# EAGLE design controlBoard-0.5 (EAGLE 8.6.3)
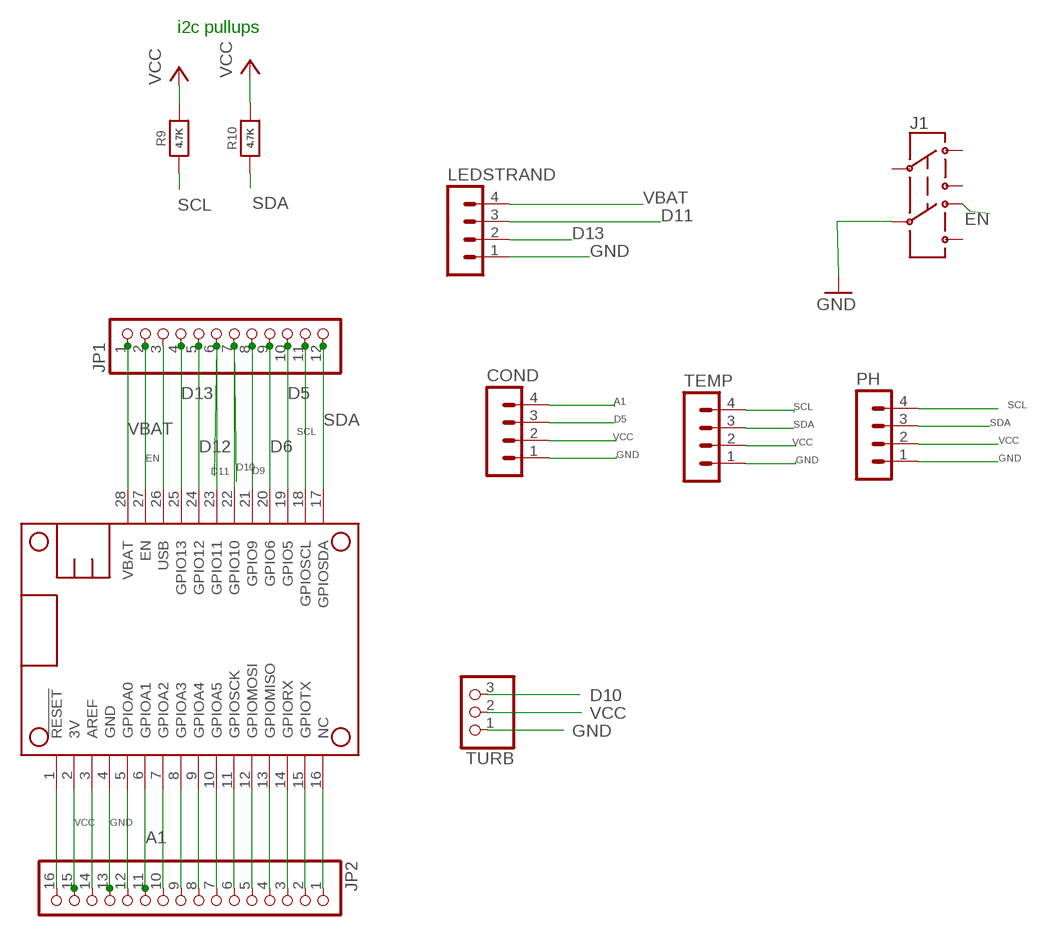
[diagram p0: schematic, sheet 1]

## Parts
COND  MA04-1  [MA04-1]
J1  AYZ0202  [AYZ0202]
JP1  PINHD-1X12  [1X12]
JP2  PINHD-1X16  [1X16]
LEDSTRAND  MA04-1  [MA04-1]
MS1  FEATHERWING  [FEATHERWING]
PH  MA04-1  [MA04-1]
R9  4.7K  RESISTOR_0603_NOOUT  [0603-NO]
R10  4.7K  RESISTOR_0603_NOOUT  [0603-NO]
TEMP  MA04-1  [MA04-1]
TURB  PINHD-1X3  [1X03]

## Nets
A1: COND.4 JP2.11 MS1.6(GPIOA1)
D5: COND.3 JP1.10 MS1.19(GPIO5)
D6: JP1.9 MS1.20(GPIO6)
D9: JP1.8 MS1.21(GPIO9)
D10: JP1.7 MS1.22(GPIO10) TURB.3
D11: JP1.6 LEDSTRAND.3 MS1.23(GPIO11)
D12: JP1.5 MS1.24(GPIO12)
D13: JP1.4 LEDSTRAND.2 MS1.25(GPIO13)
EN: J1.6 JP1.2 MS1.27(EN)
GND: COND.1 J1.5 JP2.13 LEDSTRAND.1 MS1.4(GND) PH.1 TEMP.1 TURB.1
N$2: JP2.1 MS1.16(NC)
N$3: JP2.2 MS1.15(GPIOTX)
N$4: JP2.3 MS1.14(GPIORX)
N$5: JP2.4 MS1.13(GPIOMISO)
N$6: JP2.5 MS1.12(GPIOMOSI)
N$7: JP2.6 MS1.11(GPIOSCK)
N$8: JP2.7 MS1.10(GPIOA5)
N$9: JP2.8 MS1.9(GPIOA4)
N$10: JP2.9 MS1.8(GPIOA3)
N$11: JP2.10 MS1.7(GPIOA2)
N$12: JP2.12 MS1.5(GPIOA0)
N$13: JP2.14 MS1.3(AREF)
N$14: JP2.16 MS1.1(!RESET)
SCL: JP1.11 MS1.18(GPIOSCL) PH.4 R9.1 TEMP.4
SDA: JP1.12 MS1.17(GPIOSDA) PH.3 R10.1 TEMP.3
USB: JP1.3 MS1.26(USB)
VBAT: JP1.1 LEDSTRAND.4 MS1.28(VBAT)
VCC: COND.2 JP2.15 MS1.2(3V) PH.2 R9.2 R10.2 TEMP.2 TURB.2
Unconnected: J1.1 J1.2 J1.3 J1.4

## Notes on the sheet
- i2c pullups

## Library data of the parts
COND LEDSTRAND PH TEMP = con-lstb:MA04-1: PIN HEADER; OC_FARNELL: unknown; OC_NEWARK: unknown
J1 = SparkFunNew:AYZ0202: SPDT Slide Switch Simple SMD single-pull double-throw slide switch. Good for less than 350mA power switch, switching UARTs between devices, etc. Spark Fun Electronics SKU : COM-00597
JP1 = pinhead:PINHD-1X12: PIN HEADER
JP2 = pinhead:PINHD-1X16: PIN HEADER
MS1 = adafruit:FEATHERWING
R9 R10 = microbuilder:RESISTOR: Resistors For new designs, use the packages preceded by an '_' character since they are more reliable: The following footprints should be used on most boards: _0402 - Standard footprint for regular board layouts _0603 - Standard footprint for regular board layouts _0805 - Standard footprint for regular board layouts _1206 - Standard footprint for regular board layouts For extremely tight-pitch boards where space is at a premium, the following 'micro-pitch' footprints can be used (smaller pads, no silkscreen outline, etc.): _0402MP - Micro-pitch footprint for very dense/compact boards _0603MP - Micro-pitch footprint for very dense/compact boards _0805MP - Micro-pitch footprint for very dense/compact boards _1206MP - Micro-pitch footprint for very dense/compact boards
TURB = pinhead:PINHD-1X3: PIN HEADER

## Board
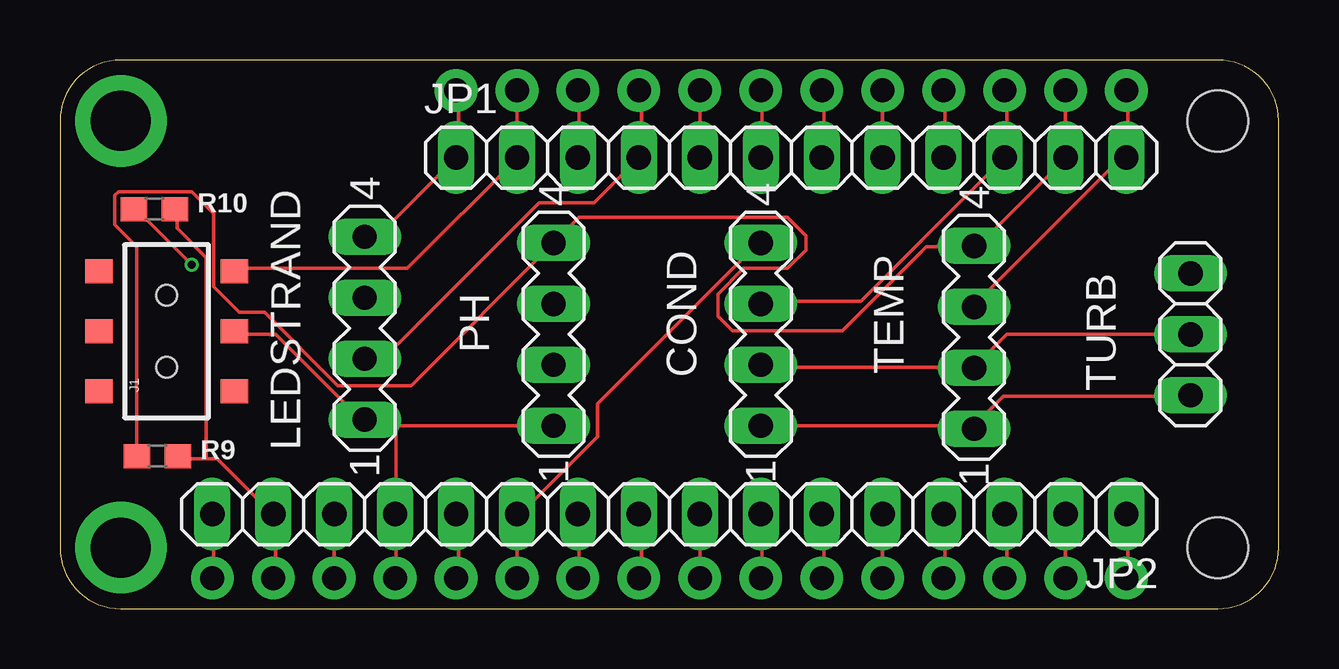
[diagram p1: board, top side]
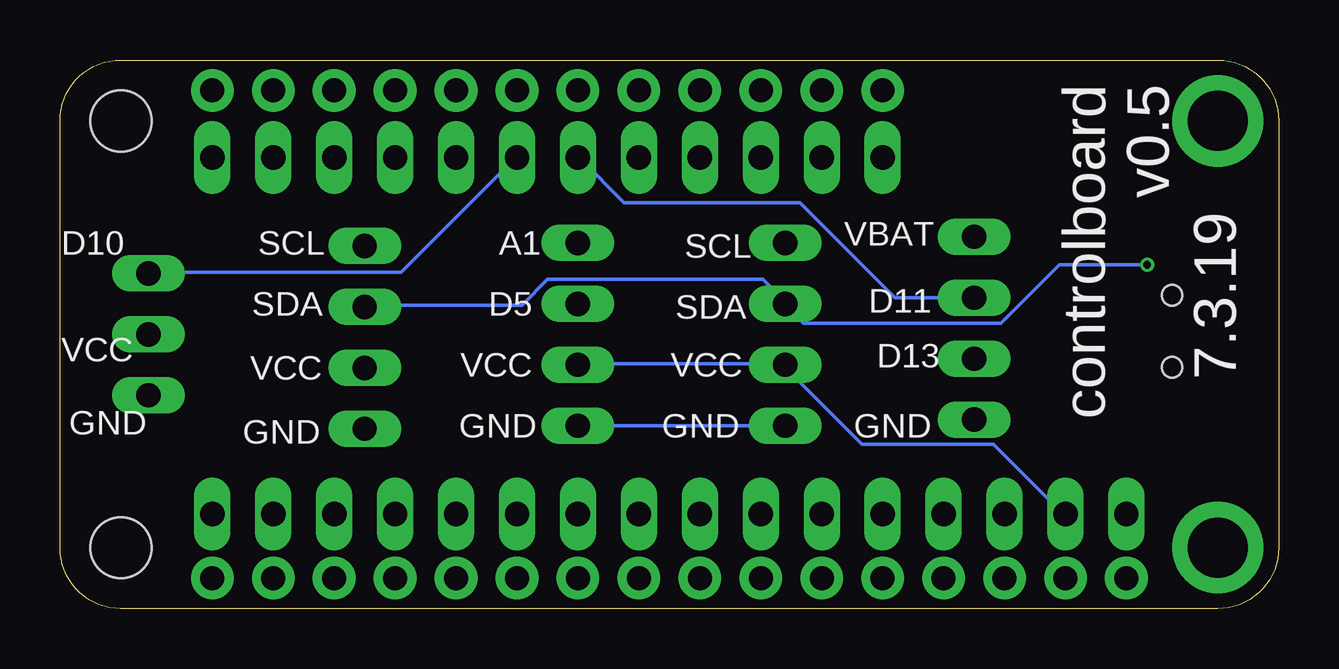
[diagram p2: board, bottom side, seen from below]

Size 50.8 x 22.86 mm. Coordinates in mm from the lower left corner, seen from the top.
Copper layers (1*16): Top 0.035559375mm / dielectric 1.6mm / Bottom 0.035559375mm
Design rules "oshpark-2layer": minimum track width 6mil, minimum drill 10mil, track to track 6mil, track to pad 6mil, pad to pad 6mil, via to via 6mil, smd to smd 6mil, copper to edge 15mil, drill to drill 6mil, minimum pad ring 5mil, minimum via ring 5mil, stop-mask expansion 2.5mil, vias tented up to drill 0mil, thermal gap 10mil
vRestrict: area 10.9,6.6 to 15,16.8; area 18.5,6.1 to 22.6,16.5; area 27.4,6.1 to 31.2,16.5; area 36.1,6.1 to 40.1,16.3; area 45.5,6.6 to 48.8,15.5; area 0.5,7.6 to 2.8,15.2; area 6.3,7.9 to 8.4,15.2; area 2,15.7 to 5.8,17.5; area 2,5.3 to 6.9,7.1

### Footprints (pad centres in the part's own frame; a part is rotated, then mirrored left to right if it is on the bottom)
MA04-1 = drill 1.016 long: 1 -3.81,0; 2 -1.27,0; 3 1.27,0; 4 3.81,0
AYZ0202 = smd 1 x 1.15: 1 -2.5,2.825; 2 0,2.825; 3 2.5,2.825; 4 -2.5,-2.825; 5 0,-2.825; 6 2.5,-2.825 | hole 0.85: 1.5,0; -1.5,0
1X12 = drill 1.016 long: 1 -13.97,0; 2 -11.43,0; 3 -8.89,0; 4 -6.35,0; 5 -3.81,0; 6 -1.27,0; 7 1.27,0; 8 3.81,0; 9 6.35,0; 10 8.89,0; 11 11.43,0; 12 13.97,0
1X16 = drill 1.016 long: 1 -19.05,0; 2 -16.51,0; 3 -13.97,0; 4 -11.43,0; 5 -8.89,0; 6 -6.35,0; 7 -3.81,0; 8 -1.27,0; 9 1.27,0; 10 3.81,0; 11 6.35,0; 12 8.89,0; 13 11.43,0; 14 13.97,0; 15 16.51,0; 16 19.05,0
FEATHERWING = drill 1 pad 1.778: 1 6.35,1.27; 2 8.89,1.27; 3 11.43,1.27; 4 13.97,1.27; 5 16.51,1.27; 6 19.05,1.27; 7 21.59,1.27; 8 24.13,1.27; 9 26.67,1.27; 10 29.21,1.27; 11 31.75,1.27; 12 34.29,1.27; 13 36.83,1.27; 14 39.37,1.27; 15 41.91,1.27; 16 44.45,1.27; 17 44.45,21.59; 18 41.91,21.59; 19 39.37,21.59; 20 36.83,21.59; 21 34.29,21.59; 22 31.75,21.59; 23 29.21,21.59; 24 26.67,21.59; 25 24.13,21.59; 26 21.59,21.59; 27 19.05,21.59; 28 16.51,21.59 | drill 2.5 pad 3.81: P$1 2.54,20.32; P$2 2.54,2.54 | hole 2.54: 48.26,20.32; 48.26,2.54
0603-NO = smd 1.1 x 1: 1 -0.85,0; 2 0.85,0
1X03 = drill 1.016 long: 1 -2.54,0; 2 0,0; 3 2.54,0

### Placement (x,y rotation side)
COND  29.21,11.43 90 top
J1  4.45,11.56 90 top
JP1  30.48,18.8 0 top
JP2  25.4,3.94 180 top
LEDSTRAND  12.7,11.68 90 top
MS1  0,0 0 top
PH  20.57,11.43 90 top
R9  4.06,6.35 0 top
R10  3.94,16.64 0 top
TEMP  38.1,11.3 90 top
TURB  47.12,11.43 90 top

### Tracks (layer width: path | path; a pad name or v marks a point on that pad's centre or on a via)
A1
  Top 0.152: MS1.6 19.05,3.81 | 19.05,3.81 22.4,7.16 22.4,8.53 29.11,15.24 COND.4 | 19.05,3.81 JP2.11
D5
  Top 0.152: COND.3 29.26,12.8 33.38,12.8 JP1.10 39.47,18.9 39.47,21.49 MS1.19
D6
  Top 0.152: JP1.9 36.88,18.9 36.88,21.49 MS1.20
D9
  Top 0.152: MS1.21 JP1.8
D10
  Top 0.152: MS1.22 31.85,21.49 31.85,18.9 JP1.7
  Bottom 0.152: TURB.3 47.09,14.02 36.58,14.02 31.85,18.75 JP1.7
D11
  Top 0.152: MS1.23 29.26,21.49 29.26,18.9 JP1.6
  Bottom 0.152: LEDSTRAND.3 16,12.95 19.96,16.92 27.28,16.92 29.11,18.75 JP1.6
D12
  Top 0.152: MS1.24 JP1.5
D13
  Top 0.152: LEDSTRAND.2 12.8,10.52 13.56,10.52 19.96,16.92 22.25,16.92 JP1.4 24.23,18.9 24.23,21.49 MS1.25
EN
  Top 0.152: J1.6 7.32,14.17 14.48,14.17 19.05,18.75 JP1.2 MS1.27
GND
  Top 0.152: MS1.4 14.02,1.37 14.02,3.81 JP2.13 14.02,3.96 14.02,7.62 | J1.5 7.32,11.43 8.99,11.43 12.65,7.77 LEDSTRAND.1 | 14.02,7.62 12.95,7.62 LEDSTRAND.1 | 14.02,7.62 PH.1 | COND.1 38.1,7.62 | 38.1,7.62 39.32,8.84 47.09,8.84 TURB.1 | 38.1,7.62 TEMP.1 | 14.02,7.62 LEDSTRAND.1
  Bottom 0.152: PH.1 COND.1
N$2
  Top 0.152: JP2.1 44.5,3.81 44.5,1.37 MS1.16
N$3
  Top 0.152: MS1.15 JP2.2
N$4
  Top 0.152: JP2.3 39.47,3.81 39.47,1.37 MS1.14
N$5
  Top 0.152: JP2.4 36.88,3.81 36.88,1.37 MS1.13
N$6
  Top 0.152: MS1.12 JP2.5
N$7
  Top 0.152: JP2.6 31.85,3.81 31.85,1.37 MS1.11
N$8
  Top 0.152: JP2.7 29.26,3.81 29.26,1.37 MS1.10
N$9
  Top 0.152: MS1.9 JP2.8
N$10
  Top 0.152: JP2.9 24.23,3.81 24.23,1.37 MS1.8
N$11
  Top 0.152: JP2.10 21.64,3.81 21.64,1.37 MS1.7
N$12
  Top 0.152: JP2.12 16.61,3.81 16.61,1.37 MS1.5
N$13
  Top 0.152: MS1.3 JP2.14
N$14
  Top 0.152: JP2.16 6.4,3.81 6.4,1.37 MS1.1
SCL
  Top 0.152: MS1.18 JP1.11 41.91,18.75 38.41,15.24 38.1,15.24 TEMP.4 38.1,15.09 36.12,15.09 32.61,11.58 28.04,11.58 27.43,12.19 27.43,13.11 28.5,14.17 30.33,14.17 31.09,14.94 31.09,15.54 30.33,16.31 21.64,16.31 PH.4 14.63,9.3 11.58,9.3 8.53,12.34 7.47,12.34 6.4,13.41 6.4,16.46 5.49,17.37 2.44,17.37 2.29,17.22 2.29,16 3.2,15.09 3.2,6.4 R9.1
SDA  (via drill 0.33)
  Top 0.152: TEMP.3 38.1,12.65 44.35,18.9 JP1.12 44.5,18.9 44.5,21.49 MS1.17 | v5.49,14.33 3.2,16.61 R10.1
  Bottom 0.152: v5.49,14.33 9.14,14.33 11.58,11.89 19.81,11.89 20.57,12.65 PH.3 20.57,12.8 21.49,13.72 30.48,13.72 31.55,12.65 38.1,12.65 TEMP.3
USB
  Top 0.152: JP1.3 21.64,18.9 21.64,21.49 MS1.26
VBAT
  Top 0.152: LEDSTRAND.4 12.8,15.54 13.26,15.54 JP1.1 16.61,18.9 16.61,21.49 MS1.28
VCC
  Top 0.152: 6.1,6.25 6.55,6.25 8.84,3.96 JP2.15 8.99,3.81 8.99,1.37 MS1.2 | 6.1,6.25 5.03,6.25 R9.2 | 6.1,6.25 6.1,14.63 4.88,15.85 4.88,16.61 R10.2 | 38.1,10.06 29.26,10.06 COND.2 | TURB.2 39.47,11.43 38.1,10.06 | 38.1,10.06 TEMP.2
  Bottom 0.152: COND.2 29.11,10.21 20.57,10.21 PH.2 20.57,10.06 17.37,6.86 11.89,6.86 8.99,3.96 JP2.15

### Text on the board
bNames: controlboard / v0.5 | 7.3.19 | VBAT | D10 | SCL | A1 | SCL | D11 | D5 | SDA | SDA | VCC | VCC | VCC | VCC | D13 | GND | GND | GND | GND | GND